# Altium schematic sheet Sensor.SchDoc
size A4
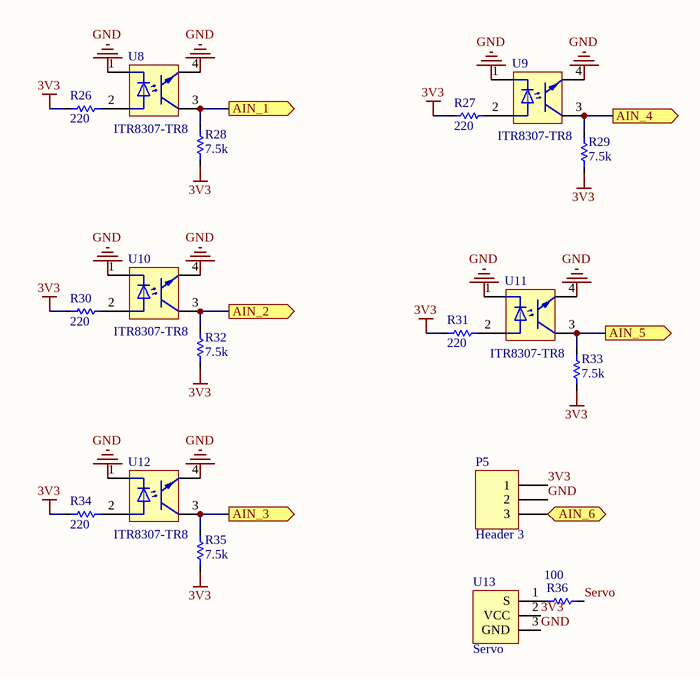
[diagram p0: Sensor.SchDoc]

## Parts
P5  Header 3  [A1.25WF-3P]
R26  220  [0603R]
R27  220  [0603R]
R28  7.5k  [0603R]
R29  7.5k  [0603R]
R30  220  [0603R]
R31  220  [0603R]
R32  7.5k  [0603R]
R33  7.5k  [0603R]
R34  220  [0603R]
R35  7.5k  [0603R]
R36  value 100  [0603R]  (hidden comment: 1K/5%)
U8  ITR8307-TR8  [SOP-4]
U9  ITR8307-TR8  [SOP-4]
U10  ITR8307-TR8  [SOP-4]
U11  ITR8307-TR8  [SOP-4]
U12  ITR8307-TR8  [SOP-4]
U13  Servo  [HDR1X3]

## Ports
AIN_1 (out), AIN_2 (out), AIN_3 (out), AIN_4 (out), AIN_5 (out), AIN_6 (out)

## Nets
3V3: P5.1 R26.2 R27.2 R28.2 R29.2 R30.2 R31.2 R32.2 R33.2 R34.2 R35.2 U13.2(VCC)
GND: P5.2 U8.1(CATHODE) U8.4(EMITTER) U9.1(CATHODE) U9.4(EMITTER) U10.1(CATHODE) U10.4(EMITTER) U11.1(CATHODE) U11.4(EMITTER) U12.1(CATHODE) U12.4(EMITTER) U13.3(GND)
AIN_1: R28.1 U8.3(COLLECTER) ; port AIN_1
AIN_2: R32.1 U10.3(COLLECTER) ; port AIN_2
AIN_3: R35.1 U12.3(COLLECTER) ; port AIN_3
AIN_4: R29.1 U9.3(COLLECTER) ; port AIN_4
AIN_5: R33.1 U11.3(COLLECTER) ; port AIN_5
AIN_6: P5.3 ; port AIN_6
Servo: R36.1
NetR26_1: R26.1 U8.2(ANODE)
NetR27_1: R27.1 U9.2(ANODE)
NetR30_1: R30.1 U10.2(ANODE)
NetR31_1: R31.1 U11.2(ANODE)
NetR34_1: R34.1 U12.2(ANODE)
NetR36_2: R36.2 U13.1(S)

## Library data of the parts
P5 = Header 3: Header, 3-Pin; LatestRevisionDate: 17-Jul-2002; LatestRevisionNote: Re-released for DXP Platform.; Publisher: Altium Limited
R26-R35 = Res1: Resistor; Value: 1K; Published: 8-Jun-2000; LatestRevisionDate: 17-Jul-2002; LatestRevisionNote: Re-released for DXP Platform.; PackageReference: AXIAL-0.3; Publisher: Altium Limited; PackageDescription: Axial Device, Thru-Hole; 2 Leads; 0.3 in Pin Spacing
R36 = Res1: Resistor; Published: 8-Jun-2000; LatestRevisionDate: 17-Jul-2002; LatestRevisionNote: Re-released for DXP Platform.; PackageReference: AXIAL-0.3; Publisher: Altium Limited; PackageDescription: Axial Device, Thru-Hole; 2 Leads; 0.3 in Pin Spacing